# Altium project ESE516_A2_Thinking.PrjPcb (part 2 of 2)

## Sheet 5V_LDO.SchDoc: 5V_LDO.SchDoc
size 558 x 431 mm; Date: 2/16/2022; Author: Xitong Zheng, Hongliang Chen; SheetNumber: 5; SheetTotal: 11
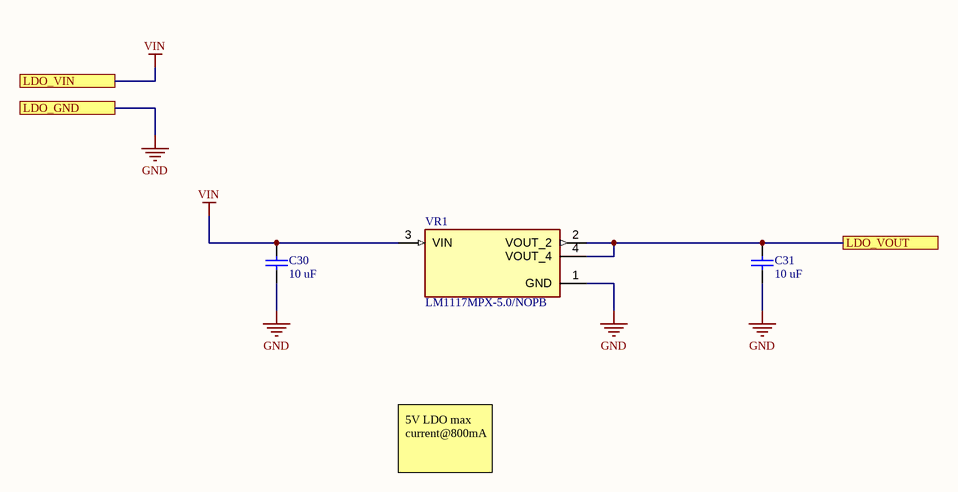
[diagram p9: 5V_LDO.SchDoc]

### Parts
C30  10 uF  [CAPC2013X95X50LL10T25]
C31  10 uF  [CAPC2013X95X50LL10T25]
VR1  LM1117MPX-5.0/NOPB  [VREG_LM1117MPX-5.0/NOPB]

### Ports
LDO_GND, LDO_VIN, LDO_VOUT

### Nets
GND: C30.1 C31.1 VR1.1(GND) ; port LDO_GND
VIN: C30.2 VR1.3(VIN) ; port LDO_VIN  [project net 6V]
LDO_VOUT: C31.2 VR1.2(VOUT_2) VR1.4(VOUT_4) ; port LDO_VOUT

### Notes on the sheet
- 5V LDO max current@800mA
- DWG. NO.
- REV.
- SHT.
- REVISION
- DESCRIPTION
- DATE
- APPROVED
- THIS DOCUMENT AND THE DATA DISCLOSED HEREIN OR HEREWITH IS THE PROPERTY OF ALTIUM LIMITED AND MAY BE FREELY DISTRIBUTED IN WHOLE. NO RIGHTS ARE RESERVED OR EXPRESS OR IMPLIED WARANTEE GIVEN.
- ENG:
- DSN:
- APPROVALS
- PROJECT
- DOCUMENT REVISION:
- DESIGN ITEM:
- CHK:
- BOM:
- REFERENCE DOCUMENTS
- PROJECT REVISION:
- TITLE
- FAB DWG:
- PCB DWG:
- ASSY DWG:
- SCALE:
- SIZE
- C
- CAGE CODE
- FILE NAME
- DWG NO.
- SHEET
- OF
- REV

### Library data of the parts
C30 C31 = CMP-2000-06497-1: Chip Capacitor, 10 uF, +/- 10%, 6.3 V, -55 to 85 degC, 0805 (2012 Metric), RoHS, Tape and Reel; Manufacturer: Taiyo Yuden; PCN Part Number: X5R,X7RDielectrics23/Jan/2008; Other Names: 587-1304-6; Capacitance: 10µF; Temperature Coefficient: X5R; Catalog Drawings: xMKSeries_0805_0.85; Voltage - Rated: 6.3V; Online Catalog: MSeries; Package Reference: 0805; Family: CeramicCapacitors; Packaging: Digi-Reel®; Thickness (Max): 0.037"(0.95mm); Ratings: -; Package / Case: 0805(2012Metric); Datasheet URL: http://www.yuden.co.jp/productdata/catalog/en/mlcc_all_e.pdf; Mounting Type: SurfaceMount,MLCC; Manufacturer URL: http://www.t-yuden.com/; Category: Capacitors; Applications: GeneralPurpose; Size / Dimension: 0.079"Lx0.049"W(2.00mmx1.25mm); Height - Seated (Max): -; Features: -; Lead Style: -; Lead Spacing: -; Standard Package: 1; Mounting Technology: SurfaceMount; Series: M; Operating Temperature: -55°C~85°C; Tolerance: ±10%; Datasheet Version: 09/2015; Package Description: 2-Pin Surface Mount Device, Body 2 x 1.25 mm
VR1 = LM1117MPX-5.0/NOPB: 800-mA 15-V linear voltage regulator 4-SOT-223 0 to 125; MF: {'manufacturer': u'ON Semiconductor'}; Value: *; MP: LM1117MPX-5.0/NOPB; Package: None; Price: None; Availability: Unavailable

## Nets that join several sheets
3V3: MAIN (5 pins), MCU (7 pins), Memory (5 pins), BME680 (R32.2 R35.2 TP20.1), APDS9960 (R31.1 TP24.1)
6V: MAIN (R22.2 TP27.1), 5V_LDO (C30.2 VR1.3)
6V_out: MAIN (R22.1), 6v_BOOST (C20.2 C21.2 D2.2 R15.2)
GND: MAIN (10 pins), FTDI (10 pins), MCU (19 pins), Memory (5 pins), LiPo_Charger (11 pins), 6v_BOOST (12 pins), BME680 (6 pins), APDS9960 (C29.2 TP25.1 U8.6), 3.3V_BUCK (5 pins), 5V_LDO (C30.1 C31.1 VR1.1)
VBAT: MAIN (P1.3), LiPo_Charger (C26.1 U6.2 U6.3)
VBUS: MAIN (J1.1), FTDI (C2.2 D1.4 FB1.1)
VOUT: MAIN (R23.2), 6v_BOOST (8 pins), 3.3V_BUCK (C8.1 U2.1 U2.8)
Vout_BQ: MAIN (R23.1), LiPo_Charger (6 pins)
VUSB: MAIN (TP1.1), FTDI (6 pins), LiPo_Charger (C24.2 U6.13)
A: MAIN (R26.1), 3.3V_BUCK (C9.1 L2.2 R27.1 U2.5)
BQ_BAT_TS: MAIN (R6.1 TP5.1), LiPo_Charger (U6.1)
FLASH_MEM_SPI_SS: MCU (U4.37), Memory (R13.1 SD1.2 TP11.1)
LDO_VOUT: MAIN (R24.1), 5V_LDO (C31.2 VR1.2 VR1.4)
MCU_LED: MAIN (DS1.2), MCU (U4.16)
MCU_RX_UART_CLI: MAIN (TP4.1), FTDI (U1.7), MCU (U4.44)
MCU_TX_UART_CLI: MAIN (TP2.1), FTDI (U1.10), MCU (U4.43)
MEM_SPI_CLK: MAIN (R10.2), Memory (SD1.5 TP10.1)
MEM_SPI_MISO: MAIN (R9.2), Memory (SD1.7 TP9.1)
MEM_SPI_MOSI: MAIN (R8.2), Memory (SD1.3 TP8.1)
SCL: MAIN (P6.2 R28.1), MCU (U4.9), BME680 (TP17.1 U7.4), APDS9960 (TP22.1 U8.7)
SDA: MAIN (P6.3 R25.1), MCU (U4.15), BME680 (TP19.1 U7.3), APDS9960 (TP23.1 U8.1)
SERCOM1_PAD2_SPI_MISO: MAIN (R9.1), MCU (U4.8)
SERCOM1_PAD2_SPI_MOSI: MAIN (R8.1), MCU (U4.11)
SERCOM1_PAD3_SPI_SCK: MAIN (R10.1), MCU (U4.12)
USB_DATA_N: MAIN (J1.2), FTDI (C5.2 D1.3 R1.1)
USB_DATA_P: MAIN (J1.3), FTDI (C6.2 D1.2 R2.1)

## Assembly variants
Build_Alt: not fitted FD1 FD2 FD3 TP1 TP2 TP3 TP4 TP5 TP6 TP7 TP8 TP9 TP10 TP11